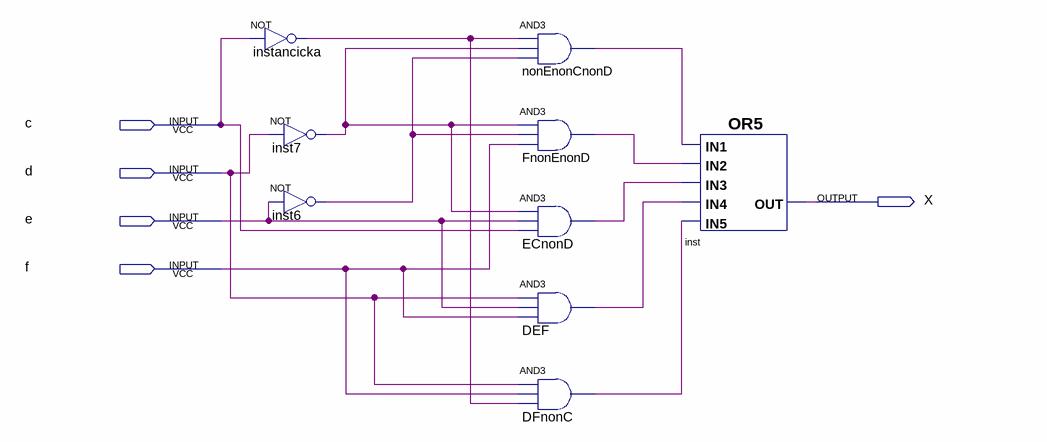
[diagram p0: schematic sheet]
// Quartus schematic JAKUJa1b0.bdf as structural Verilog: 9 symbols, 5 pins
module JAKUJa1b0 (
  input  c,
  input  d,
  input  e,
  input  f,
  output X
);

  wire DEF_out, DFnonC_out, ECnonD_out, FnonEnonD_out, inst6_out, inst7_out, instancicka_out,
       nonEnonCnonD_out;

  not instancicka (instancicka_out, c);
  not inst7 (inst7_out, d);
  not inst6 (inst6_out, e);
  and nonEnonCnonD (nonEnonCnonD_out, instancicka_out, inst7_out, inst6_out);
  and FnonEnonD (FnonEnonD_out, inst7_out, inst6_out, f);
  and ECnonD (ECnonD_out, inst7_out, e, c);
  and DEF (DEF_out, d, e, f);
  and DFnonC (DFnonC_out, d, f, instancicka_out);
  or inst (X, nonEnonCnonD_out, FnonEnonD_out, ECnonD_out, DEF_out, DFnonC_out);
endmodule
